# EAGLE schematic 10ma-rcbo-mcb-and-anti-external-cb-trip (EAGLE 7.6.0)
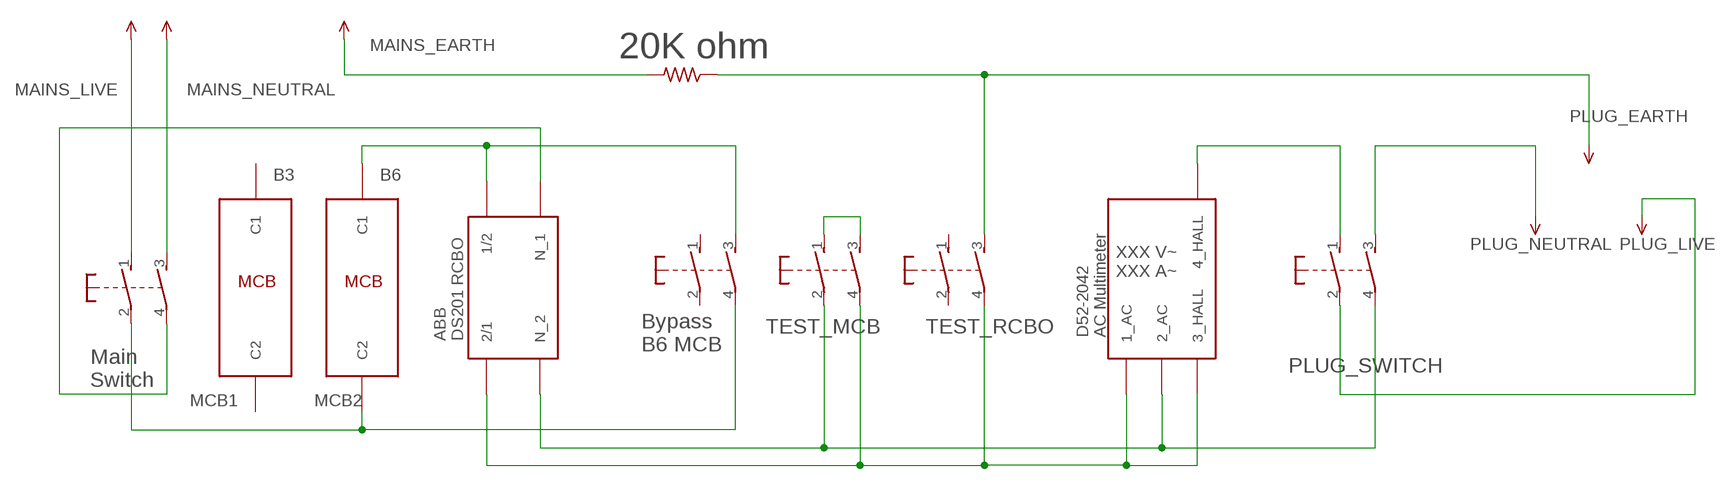
[diagram p0: schematic, sheet 1]

## Parts
MCB1  B3  MCB  (no package)
MCB2  B6  MCB  (no package)
R1  20K ohm  R-US_0207/10  [0207/10]
S1  PVA1  [PVA1F]
S3  PVA1  [PVA1F]
S4  PVA1  [PVA1F]
S5  PVA1  [PVA1F]
S6  PVA1  [PVA1F]
U$1  AC_MULTIMETER  (no package)
U$2  DS201  (no package)

## Nets
N$1: MCB2.C2 S3.2(1:P) S4.4(2:P)
N$2: S5.1(1:S) S5.3(2:S)
N$3: S5.4(2:P) S6.4(2:P) U$1.1_AC U$1.3_HALL U$2.2/1
N$4: S1.1(1:S) U$1.4_HALL
N$6: S3.4(2:P) U$2.N_1
N$9: S1.4(2:P) S5.2(1:P) U$1.2_AC U$2.N_2
N$11: MCB2.C1 S4.3(2:S) U$2.1/2
V: R1.1 R1.2 S1.2(1:P) S1.3(2:S) S3.1(1:S) S3.3(2:S) S6.3(2:S)
Unconnected: MCB1.C1 MCB1.C2 S4.1(1:S) S4.2(1:P) S6.1(1:S) S6.2(1:P)

## Notes on the sheet
- TEST_MCB | TEST_RCBO
- Bypass 
  B6 MCB
- PLUG_SWITCH
- Main
  Switch

## Library data of the parts
MCB1 MCB2 = mcb:MCB
R1 = resistor:R-US_: RESISTOR, American symbol
S1 S3-S6 = switch-misc:PVA1: ITT SWITCH
U$1 = d52-2042:AC_MULTIMETER
U$2 = ds201:DS201